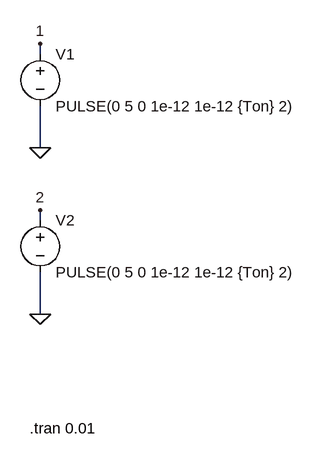
[diagram p0: schematic мостовая схема.asc]
мостовая схема.asc, the LTspice schematic file:
Version 4
SHEET 1 1584 784
WIRE 256 192 256 176
WIRE 256 336 256 272
WIRE 256 448 256 432
WIRE 256 592 256 528
FLAG 256 176 1
FLAG 256 336 0
FLAG 256 432 2
FLAG 256 592 0
SYMBOL voltage 256 176 R0
WINDOW 123 0 0 Left 0
WINDOW 39 0 0 Left 0
SYMATTR InstName V1
SYMATTR Value PULSE(0 5 0 1e-12 1e-12 {Ton} 2)
SYMBOL voltage 256 432 R0
WINDOW 123 0 0 Left 0
WINDOW 39 0 0 Left 0
SYMATTR InstName V2
SYMATTR Value PULSE(0 5 0 1e-12 1e-12 {Ton} 2)
TEXT 240 768 Left 2 !.tran 0.01

The netlist it stands for:
* мостовая схема.asc
V1 1 0 PULSE(0 5 0 1e-12 1e-12 {Ton} 2)
V2 2 0 PULSE(0 5 0 1e-12 1e-12 {Ton} 2)
.tran 0.01
.backanno
.end